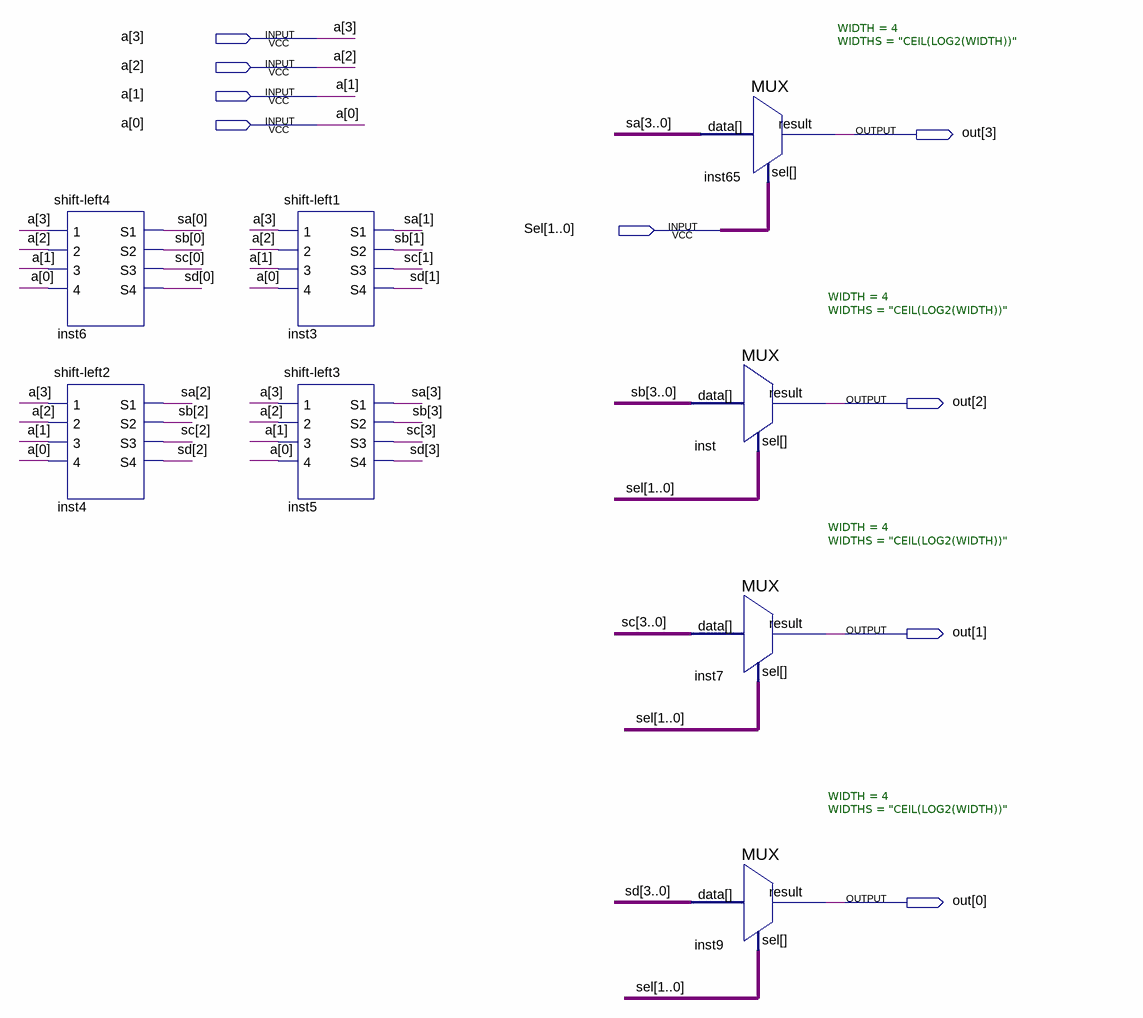
[diagram p0: schematic sheet]
// Quartus schematic shift-comMux.bdf as structural Verilog: 8 symbols, 9 pins
module \shift-comMux  (
  input  [3:0] a,
  input  [1:0] Sel,
  output [3:0] out
);

  wire [3:0] sa, sb, sc, sd;

  \shift-left4  inst6 (.\1 (a[3]), .\2 (a[2]), .\3 (a[1]), .\4 (a[0]), .S1(sa[0]), .S2(sb[0]), .S3(sc[0]), .S4(sd[0]));
  \shift-left2  inst4 (.\1 (a[3]), .\2 (a[2]), .\3 (a[1]), .\4 (a[0]), .S1(sa[2]), .S2(sb[2]), .S3(sc[2]), .S4(sd[2]));
  \shift-left1  inst3 (.\1 (a[3]), .\2 (a[2]), .\3 (a[1]), .\4 (a[0]), .S1(sa[1]), .S2(sb[1]), .S3(sc[1]), .S4(sd[1]));
  \shift-left3  inst5 (.\1 (a[3]), .\2 (a[2]), .\3 (a[1]), .\4 (a[0]), .S1(sa[3]), .S2(sb[3]), .S3(sc[3]), .S4(sd[3]));
  MUX #(.WIDTH(4), .WIDTHS("CEIL(LOG2(WIDTH))")) inst65 (.data(sa), .sel(Sel), .result(out[3]));
  MUX #(.WIDTH(4), .WIDTHS("CEIL(LOG2(WIDTH))")) inst (.data(sb), .sel(Sel), .result(out[2]));
  MUX #(.WIDTH(4), .WIDTHS("CEIL(LOG2(WIDTH))")) inst7 (.data(sc), .sel(Sel), .result(out[1]));
  MUX #(.WIDTH(4), .WIDTHS("CEIL(LOG2(WIDTH))")) inst9 (.data(sd), .sel(Sel), .result(out[0]));
endmodule
